# Altium schematic sheet ValentinesFlower.SchDoc
size A4; SheetNumber: 1; SheetTotal: 1
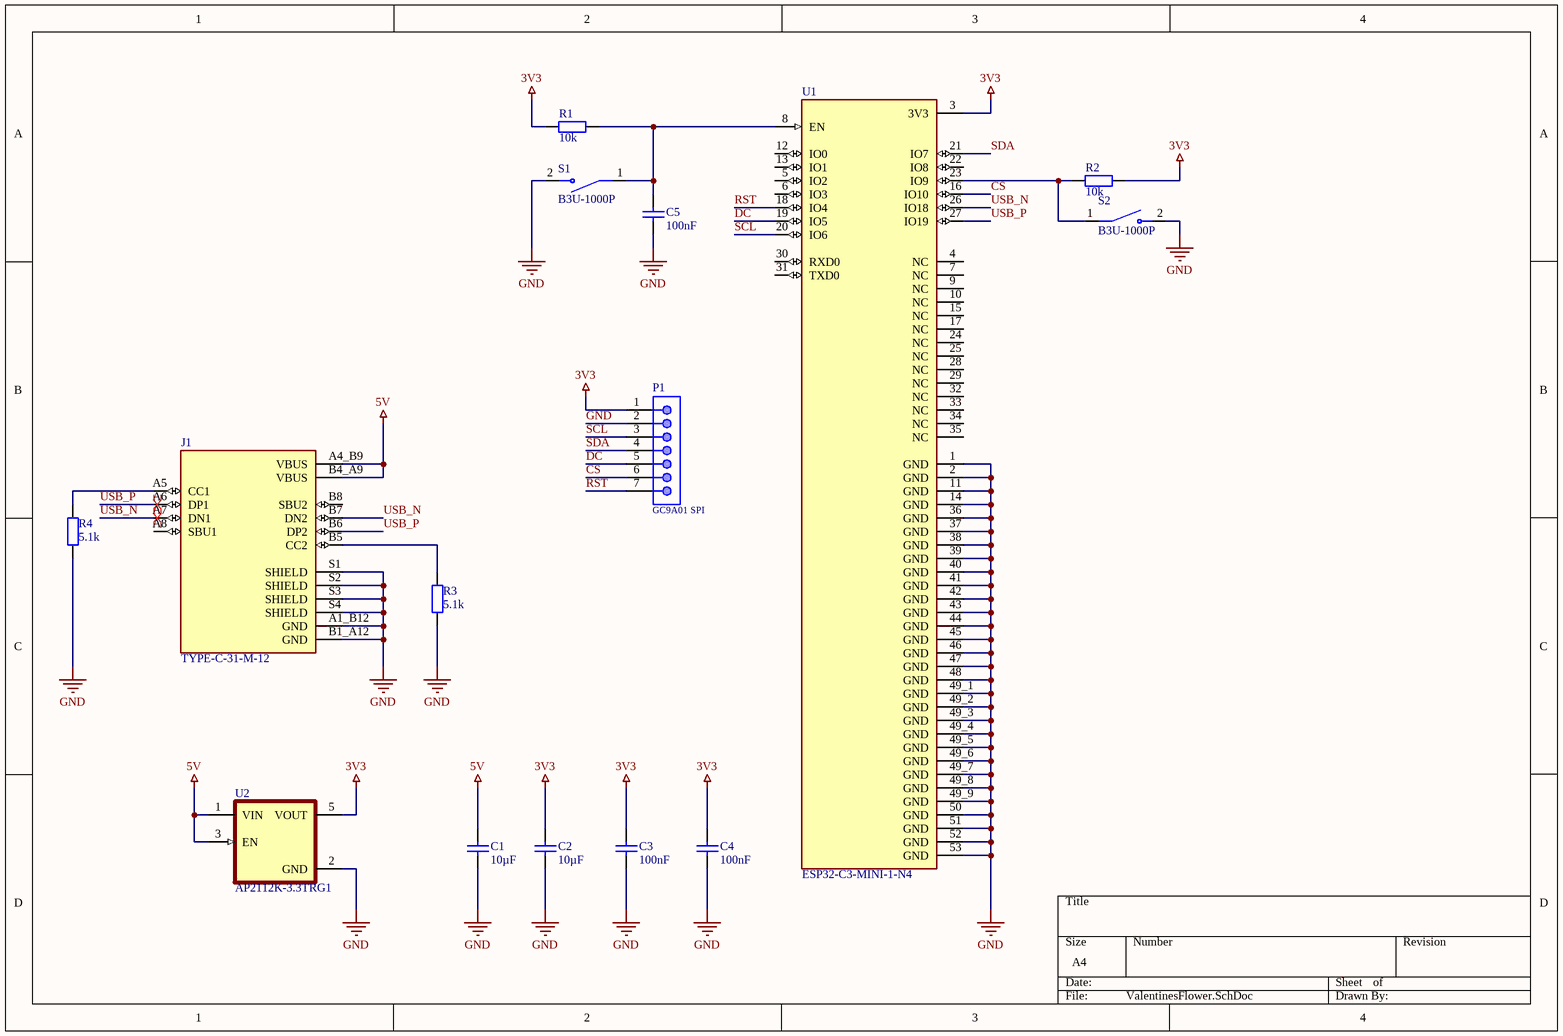
[diagram p0: ValentinesFlower.SchDoc]

## Parts
C1  10µF  [WCAP-CSGP_0805_H=0.6mm_Reflow]
C2  10µF  [WCAP-CSGP_0805_H=0.6mm_Reflow]
C3  100nF  [WCAP-CSGP_0805_H=0.6mm_Reflow]
C4  100nF  [WCAP-CSGP_0805_H=0.6mm_Reflow]
C5  100nF  [WCAP-CSGP_0805_H=0.6mm_Reflow]
J1  TYPE-C-31-M-12  [HRO_TYPE-C-31-M-12]
P1  GC9A01 SPI  [61300711121]
R1  10k  [WRIS-PSMB_0805_H=0.35mm]
R2  10k  [WRIS-PSMB_0805_H=0.35mm]
R3  5.1k  [WRIS-PSMB_0805_H=0.35mm]
R4  5.1k  [WRIS-PSMB_0805_H=0.35mm]
S1  B3U-1000P  [SW_B3U-1000P]
S2  B3U-1000P  [SW_B3U-1000P]
U1  ESP32-C3-MINI-1-N4  [XCVR_ESP32-C3-MINI-1-N4]
U2  AP2112K-3.3TRG1  [SOT95P285X140-5N]

## Nets
3V3: C2.2 C3.2 C4.2 P1.1 R1.1 R2.2 U1.3(3V3) U2.5(VOUT)
5V: C1.2 J1.A4_B9(VBUS) J1.B4_A9(VBUS) U2.1(VIN) U2.3(EN)
GND: C1.1 C2.1 C3.1 C4.1 C5.1 J1.A1_B12(GND) J1.B1_A12(GND) J1.S1(SHIELD) J1.S2(SHIELD) J1.S3(SHIELD) J1.S4(SHIELD) P1.2 R3.1 R4.1 S1.2 S2.2 U1.1(GND) U1.2(GND) U1.11(GND) U1.14(GND) U1.36(GND) U1.37(GND) U1.38(GND) U1.39(GND) U1.40(GND) U1.41(GND) U1.42(GND) U1.43(GND) U1.44(GND) U1.45(GND) U1.46(GND) U1.47(GND) U1.48(GND) U1.49_1(GND) U1.49_2(GND) U1.49_3(GND) U1.49_4(GND) U1.49_5(GND) U1.49_6(GND) U1.49_7(GND) U1.49_8(GND) U1.49_9(GND) U1.50(GND) U1.51(GND) U1.52(GND) U1.53(GND) U2.2(GND)
CS: P1.6 U1.16(IO10)
DC: P1.5 U1.19(IO5)
RST: P1.7 U1.18(IO4)
SCL: P1.3 U1.20(IO6)
SDA: P1.4 U1.21(IO7)
USB_N: J1.A7(DN1) J1.B7(DN2) U1.26(IO18)
USB_P: J1.A6(DP1) J1.B6(DP2) U1.27(IO19)
NetC5_2: C5.2 R1.2 S1.1 U1.8(EN)
NetJ1_A5: J1.A5(CC1) R4.2
NetJ1_B5: J1.B5(CC2) R3.2
NetR2_1: R2.1 S2.1 U1.23(IO9)

Not connected (* = marked no-connect by the designer): J1 A8(SBU1) B8(SBU2); U1 4(NC) 5(IO2) 6(IO3) 7(NC) 9(NC) 10(NC) 12(IO0) 13(IO1) 15(NC) 17(NC) 22(IO8) 24(NC) 25(NC) 28(NC) 29(NC) 30(RXD0) 31(TXD0) 32(NC) 33(NC) 34(NC) 35(NC)

## Layout directives
differential pair: USB_N, USB_P

## Library data of the parts
C1-C5 = 885012007059: WCAP-CSGP General Purpose Ceramic Capacitors, size 0805, 220pF, +/-5%, 50VDC; Isolation Resistance: >=10GOhm; Ceramic Type: NP0; Dissipation Factor: Q>=1000; Technical Reference: NP00805221J050DFCT10000; ComponentLink1Description: Manufacturer; ComponentLink1URL: http://www.we-online.de; ComponentLink2Description: Datasheet; ComponentLink2URL: https://katalog.we-online.com/pbs/datasheet/885012007059.pdf; Operating Temperature: -55 to +125degC; Packaging: Tape and Reel; Part Number: 885012007059; Publisher: Wurth Elektronik; Rated Voltage: 50VDC; Published Date: August 2019; Capacitance Tolerance: +/-5%; Height: 0.6mm +/-0.10mm; Mounting Technology: SMD; Size: 0805; Capacitance: 220pF
J1 = TYPE-C-31-M-12: USB Connectors 24 Receptacle 1 8.94*7.3mm RoHS; MF: HRO Electronics Co., Ltd.; SnapEDA_Link: https://www.snapeda.com/parts/TYPE-C-31-M-12/HRO+Electronics+Co.%252C+Ltd./view-part/?ref=snap; Package: Package; Value: *; MP: TYPE-C-31-M-12; Check_prices: https://www.snapeda.com/parts/TYPE-C-31-M-12/HRO+Electronics+Co.%252C+Ltd./view-part/?ref=eda
P1 = 61300711121: WR-PHD Pin Header, THT, pitch 2.54mm, Single Row, Vertical, 7p; Manufacturer: Wurth Elektronik; Pin Number: 7; Rated Current: 3A; Working Voltage: 250VAC; Withstanding Voltage: 500VAC; Contact Resistance: 20mOhm; ComponentLink1Description: Manufacturer; ComponentLink1URL: http://www.we-online.de; ComponentLink2Description: Datasheet; ComponentLink2URL: https://www.we-online.com/catalog/datasheet/61300711121.pdf; Manufacturer Part Number: 61300711121; Published Date: May 2020; Pitch: 2.54mm; Operating Temperature: -40 to +105degC; Mounting Technology: THT; Packaging: Bag; Gender: Pin Header; Row Number: Single; Orientation: Vertical
R1-R4 = 580060720003: WRIS-PSMB Metal Plate Resistors, size 0805, 5mOhm, +/-1%, 0.5W; Rated Current: 10A; Temperature Coefficient of Resistance: +/-100ppm/degC; Technical Reference: MB0805R005F102KAATP0000; ComponentLink1Description: Manufacturer; ComponentLink1URL: http://www.we-online.de; ComponentLink2Description: Datasheet; ComponentLink2URL: https://katalog.we-online.com/pbs/datasheet/580060720003.pdf; Publisher: Wurth Elektronik; Rated Power: 0.5W; Resistance: 5mOhm; Mounting Technology: SMT; Height: 0.35mm; Part Number: 580060720003; Packaging: Tape and Reel; Published Date: September 2019; Size: 0805; Length: 2mm; Operating Temperature: -55 to +155degC; Resistance Tolerance: +/-1%; Width: 1.25mm
S1 S2 = B3U-1000P: Switch Tactile N.O. SPST Round Button Gull Wing 0.05A 12VDC 1.5N SMD Embossed T/R; Price: None; MP: B3U-1000P; Availability: Unavailable; Value: *; Package: None
U1 = ESP32-C3-MINI-1-N4: MF: {'manufacturer': u'Espressif Systems'}; Package: None; Price: None; Value: *; MP: ESP32-C3-MINI-1-N4; Availability: Unavailable
U2 = AP2112K-3.3TRG1: Linear Voltage Regulator IC Positive Fixed 1 Output 600mA SOT-25; MF: Diodes Inc.; Value: *; Purchase-URL: https://pricing.snapeda.com/search/part/AP2112K-3.3TRG1/?ref=eda; Package: SOT-753 Diodes Inc.; Availability: In Stock; Check_prices: https://www.snapeda.com/parts/AP2112K-3.3TRG1/Diodes+Inc./view-part/?ref=eda; Price: None; SnapEDA_Link: https://www.snapeda.com/parts/AP2112K-3.3TRG1/Diodes+Inc./view-part/?ref=snap; MP: AP2112K-3.3TRG1